# EAGLE design modular-mechaduino (EAGLE 9.6.2)
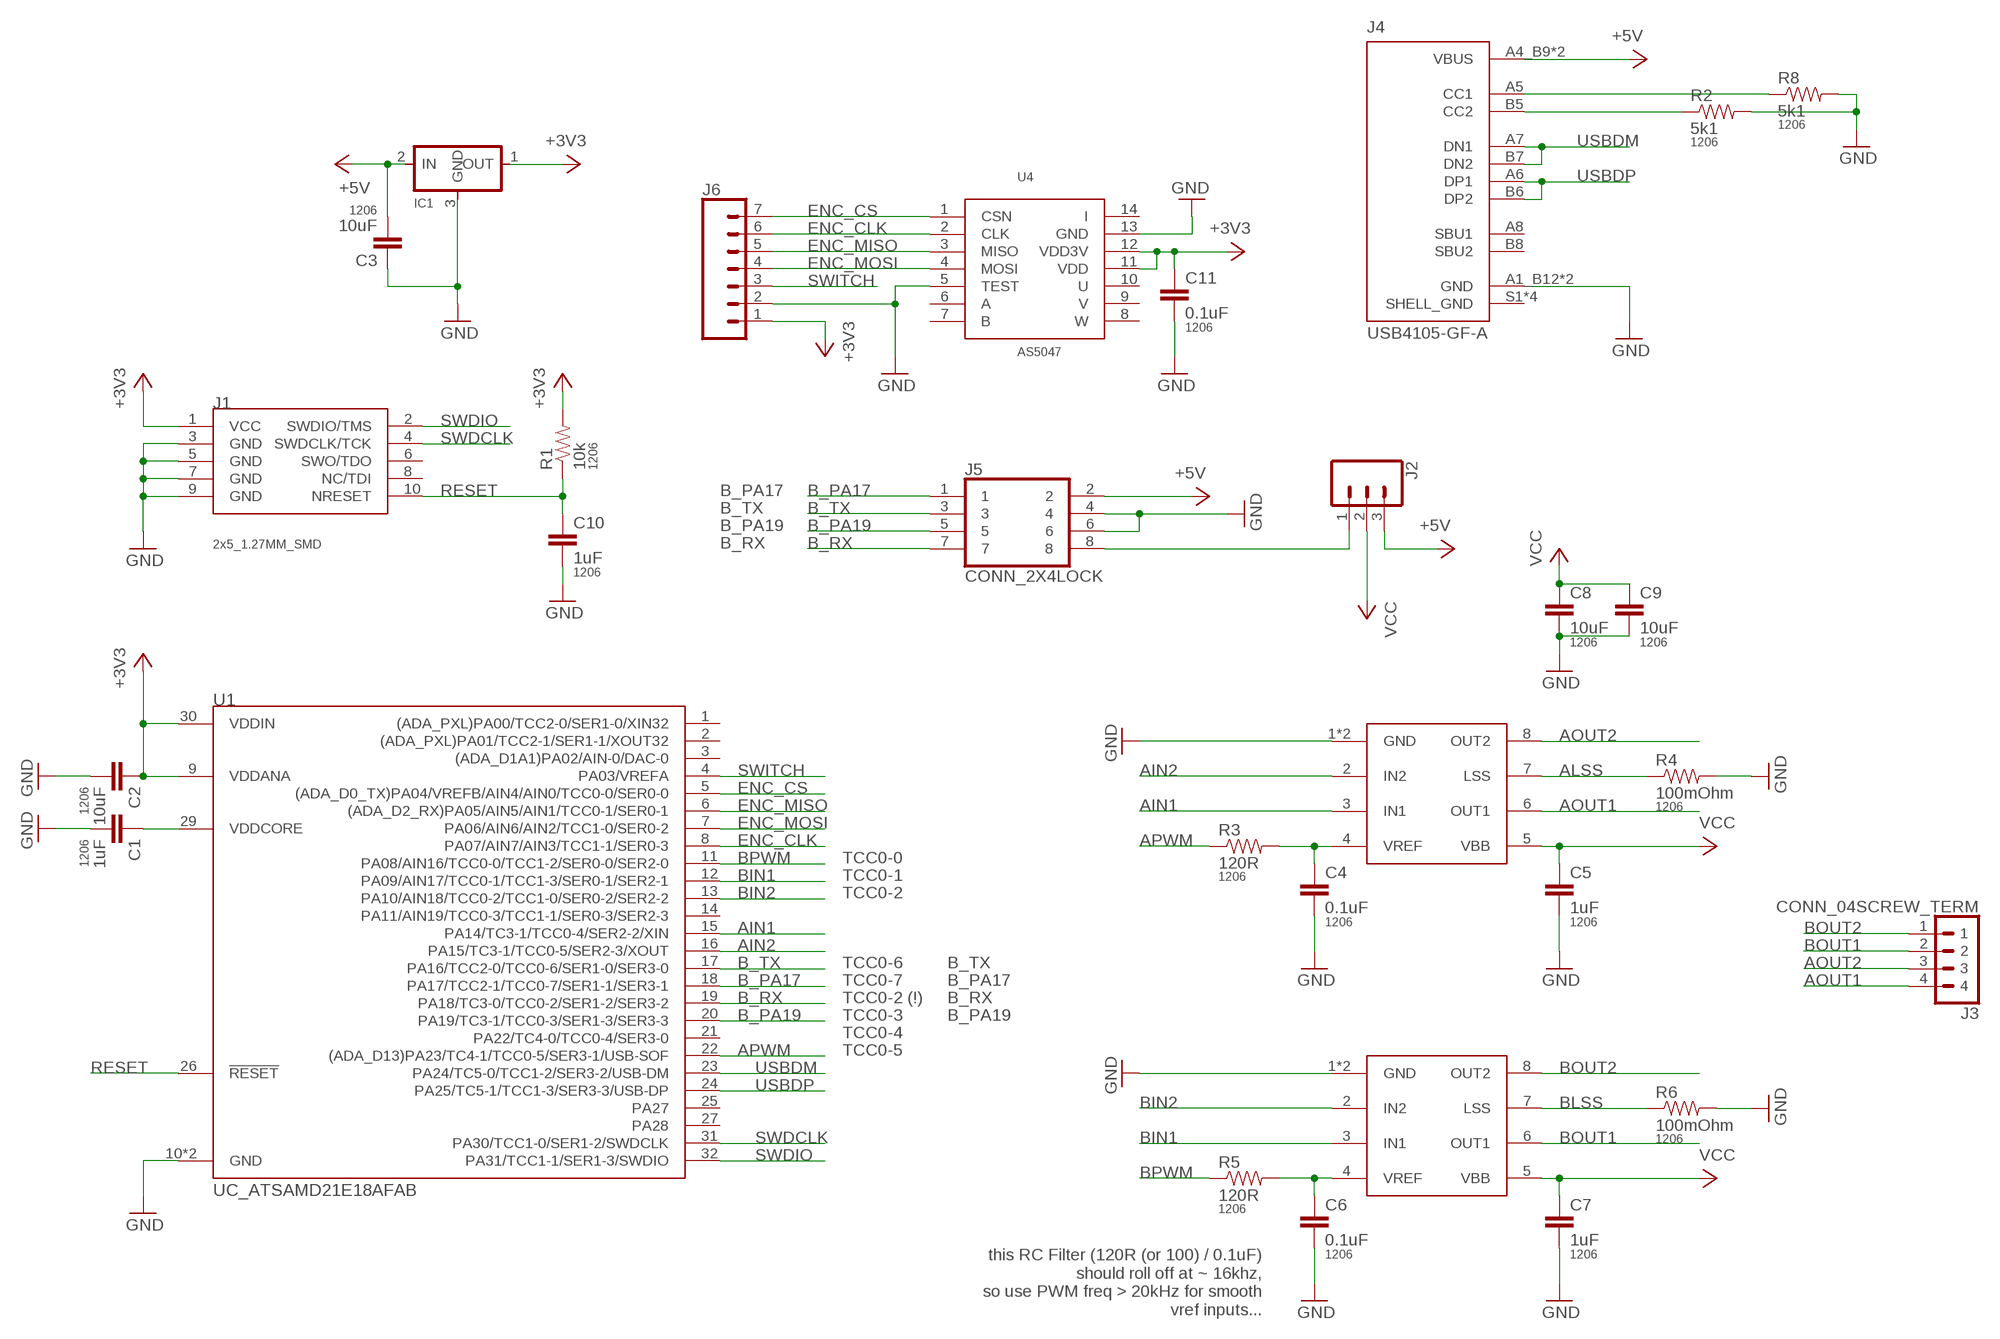
[diagram p0: schematic, sheet 1]

## Parts
C1  1uF  CAP1206  [1206]
C2  10uF  CAP1206  [1206]
C3  10uF  CAP1206  [1206]
C4  0.1uF  CAP1206  [1206]
C5  1uF  CAP1206  [1206]
C6  0.1uF  CAP1206  [1206]
C7  1uF  CAP1206  [1206]
C8  10uF  CAP1206  [1206]
C9  10uF  CAP1206  [1206]
C10  1uF  CAP1206  [1206]
C11  0.1uF  CAP1206  [1206]
IC1  VR_REGULATOR-SOT23SOT23  [SOT23]
J1  CONN_05X2_ARM_DEBUGSMD  [2X5_1.27MM_SMD]
J2  CONN_03LOCK_NO_SILK  [1X03_LOCK_NO_SILK]
J3  CONN_04SCREW_TERM  [1X04_SCREW-TERM]
J4  USB4105-GF-A  [GCT_USB4105-GF-A]
J5  CONN_2X4LOCK  [2X4-LOCK]
J6  CONN_07NO_SILK  [1X07_NO_SILK]
R1  10k  RESISTOR1206  [1206]
R2  5k1  RESISTOR1206  [1206]
R3  120R  RESISTOR1206  [1206]
R4  100mOhm  RESISTOR1206  [1206]
R5  120R  RESISTOR1206  [1206]
R6  100mOhm  RESISTOR1206  [1206]
R8  5k1  RESISTOR1206  [1206]
U1  UC_ATSAMD21E18AFAB  [TQFP-32-FAB]
U2  A4950  [SOIC8_PAD]
U3  A4950  [SOIC8_PAD]
U4  AS5047  [TSSOP14]

## Nets
+3V3: C2.1 C11.1 IC1.1(OUT) J1.1(VCC) J6.1 R1.2 U1.9(VDDANA) U1.30(VDDIN) U4.11(VDD) U4.12(VDD3V)
+5V: C3.2 IC1.2(IN) J2.3 J4.A4_B9(VBUS) J4.B4_A9(VBUS) J5.2
AIN1: U1.15(PA14/TC3-1/TCC0-4/SER2-2/XIN) U2.3(IN1)
AIN2: U1.16(PA15/TC3-1/TCC0-5/SER2-3/XOUT) U2.2(IN2)
ALSS: R4.1 U2.7(LSS)
AOUT1: J3.4 U2.6(OUT1)
AOUT2: J3.3 U2.8(OUT2)
APWM: R3.1 U1.22((ADA_D13)PA23/TC4-1/TCC0-5/SER3-1/USB-SOF)
B_PA17: J5.1 U1.18(PA17/TCC2-1/TCC0-7/SER1-1/SER3-1)
B_PA19: J5.5 U1.20(PA19/TC3-1/TCC0-3/SER1-3/SER3-3)
B_RX: J5.7 U1.19(PA18/TC3-0/TCC0-2/SER1-2/SER3-2)
B_TX: J5.3 U1.17(PA16/TCC2-0/TCC0-6/SER1-0/SER3-0)
BIN1: U1.12(PA09/AIN17/TCC0-1/TCC1-3/SER0-1/SER2-1) U3.3(IN1)
BIN2: U1.13(PA10/AIN18/TCC0-2/TCC1-0/SER0-2/SER2-2) U3.2(IN2)
BLSS: R6.1 U3.7(LSS)
BOUT1: J3.2 U3.6(OUT1)
BOUT2: J3.1 U3.8(OUT2)
BPWM: R5.1 U1.11(PA08/AIN16/TCC0-0/TCC1-2/SER0-0/SER2-0)
ENC_CLK: J6.6 U1.8(PA07/AIN7/AIN3/TCC1-1/SER0-3) U4.2(CLK)
ENC_CS: J6.7 U1.5((ADA_D0_TX)PA04/VREFB/AIN4/AIN0/TCC0-0/SER0-0) U4.1(CSN)
ENC_MISO: J6.5 U1.6((ADA_D2_RX)PA05/AIN5/AIN1/TCC0-1/SER0-1) U4.3(MISO)
ENC_MOSI: J6.4 U1.7(PA06/AIN6/AIN2/TCC1-0/SER0-2) U4.4(MOSI)
GND: C1.2 C2.2 C3.1 C4.2 C5.2 C6.2 C7.2 C8.2 C9.2 C10.2 C11.2 IC1.3(GND) J1.3(GND) J1.5(GND) J1.7(GND) J1.9(GND) J4.A1_B12(GND) J4.B1_A12(GND) J5.4 J5.6 J6.2 R2.2 R4.2 R6.2 R8.2 U1.10(GND) U1.28(GND) U2.1(GND) U2.P$1(GND) U3.1(GND) U3.P$1(GND) U4.5(TEST) U4.13(GND)
N$1: C1.1 U1.29(VDDCORE)
N$2: C4.1 R3.2 U2.4(VREF)
N$3: J4.B5(CC2) R2.1
N$4: J4.A5(CC1) R8.1
N$6: C6.1 R5.2 U3.4(VREF)
N$10: J2.1 J5.8
RESET: C10.1 J1.10(NRESET) R1.1 U1.26(!RESET)
SWDCLK: J1.4(SWDCLK/TCK) U1.31(PA30/TCC1-0/SER1-2/SWDCLK)
SWDIO: J1.2(SWDIO/TMS) U1.32(PA31/TCC1-1/SER1-3/SWDIO)
SWITCH: J6.3 U1.4(PA03/VREFA)
USBDM: J4.A7(DN1) J4.B7(DN2) U1.23(PA24/TC5-0/TCC1-2/SER3-2/USB-DM)
USBDP: J4.A6(DP1) J4.B6(DP2) U1.24(PA25/TC5-1/TCC1-3/SER3-3/USB-DP)
VCC: C5.1 C7.1 C8.1 C9.1 J2.2 U2.5(VBB) U3.5(VBB)
Unconnected: J1.6(SWO/TDO) J1.8(NC/TDI) J4.A8(SBU1) J4.B8(SBU2) U1.1((ADA_PXL)PA00/TCC2-0/SER1-0/XIN32) U1.2((ADA_PXL)PA01/TCC2-1/SER1-1/XOUT32) U1.3((ADA_D1A1)PA02/AIN-0/DAC-0) U1.14(PA11/AIN19/TCC0-3/TCC1-1/SER0-3/SER2-3) U1.21(PA22/TC4-0/TCC0-4/SER3-0) U1.25(PA27) U1.27(PA28) U4.6(A) U4.7(B) U4.8(W) U4.9(V) U4.10(U) U4.14(I)

## Notes on the sheet
- B_PA17
- B_TX
- B_PA19
- B_RX
- TCC0-0
- TCC0-1
- TCC0-2
- TCC0-6 | B_TX
- TCC0-7 | B_PA17
- TCC0-2 (!) | B_RX
- TCC0-3 | B_PA19
- TCC0-4
- TCC0-5
- this RC Filter (120R (or 100) / 0.1uF)
  should roll off at ~ 16khz,
  so use PWM freq > 20kHz for smooth
  vref inputs...

## Power pins joined to a net without a drawn wire
SHELL_GND: J4.S1(SHELL_GND) J4.S2(SHELL_GND) J4.S3(SHELL_GND) J4.S4(SHELL_GND)

## Library data of the parts
C1-C11 = jrr_passives:CAP: Capacitor Standard 0603 ceramic capacitor, and 0.1" leaded capacitor.; PACKAGE: 1206
IC1 = fablab:VR_REGULATOR-SOT23
J1 = fablab:CONN_05X2_ARM_DEBUG; PACKAGE: 2x5_1.27MM_SMD
J2 = SparkFun-Connectors:CONN_03: Multi connection point. Often used as Generic Header-pin footprint for 0.1 inch spaced/style header connections On any of the 0.1 inch spaced packages, you can populate with these: Break Away Headers - Straight <https://www.sparkfun.com/products/116> (PRT-00116) Break Away Male Headers - Right Angle <https://www.sparkfun.com/products/553> (PRT-00553) Female Headers <https://www.sparkfun.com/products/115> (PRT-00115) Break Away Headers - Machine Pin <https://www.sparkfun.com/products/117> (PRT-00117) Break Away Female Headers - Swiss Machine Pin <https://www.sparkfun.com/products/743> (PRT-00743) Stackable Header - 3 Pin (Female, 0.1") <https://www.sparkfun.com/products/13875> (PRT-13875) For SCREWTERMINALS and SPRING TERMINALS visit here: Screw Terimnals on SparkFun.com <https://www.sparkfun.com/search/results?term=Screw+Terminals> (5mm/3.5mm/2.54mm spacing) This device is also useful as a general connection point to wire up your design to another part of your project. Our various solder wires solder well into these plated through hole pads. Hook-Up Wire - Assortment (Stranded, 22 AWG) <https://www.sparkfun.com/products/11375> (PRT-11375) Hook-Up Wire - Assortment (Solid Core, 22 AWG) <https://www.sparkfun.com/products/11367> (PRT-11367) View the entire wire category on our website here <https://www.sparkfun.com/categories/141> Special notes: Molex polarized connector foot print use with SKU : PRT-08232 with associated crimp pins and housings.
J3 = jrr_connector:CONN_04
J4 = jrr_connector:USB4105-GF-A: USB-C (USB TYPE-C) USB 2.0 Receptacle Connector 24 (16+8 Dummy) Position Surface Mount, Right Angle; Through Hole Check prices <https://pricing.snapeda.com/parts/USB4105-GF-A/GCT/view-part?ref=eda>; AVAILABILITY: In Stock; DESCRIPTION: USB-C (USB TYPE-C) USB 2.0 Receptacle Connector 24 (16+8 Dummy) Position Surface Mount, Right Angle; Through Hole; MF: GCT; MP: USB4105-GF-A; PACKAGE: None; PRICE: None; PURCHASE-URL: https://pricing.snapeda.com/search/part/USB4105-GF-A/?ref=eda
J5 = jrr_connector:CONN_2X4
J6 = SparkFun-Connectors:CONN_07: Multi connection point. Often used as Generic Header-pin footprint for 0.1 inch spaced/style header connections On any of the 0.1 inch spaced packages, you can populate with these: Break Away Headers - Straight <https://www.sparkfun.com/products/116> (PRT-00116) Break Away Male Headers - Right Angle <https://www.sparkfun.com/products/553> (PRT-00553) Female Headers <https://www.sparkfun.com/products/115> (PRT-00115) Break Away Headers - Machine Pin <https://www.sparkfun.com/products/117> (PRT-00117) Break Away Female Headers - Swiss Machine Pin <https://www.sparkfun.com/products/743> (PRT-00743) For SCREWTERMINALS and SPRING TERMINALS visit here: Screw Terimnals on SparkFun.com <https://www.sparkfun.com/search/results?term=Screw+Terminals> (5mm/3.5mm/2.54mm spacing) This device is also useful as a general connection point to wire up your design to another part of your project. Our various solder wires solder well into these plated through hole pads. Hook-Up Wire - Assortment (Stranded, 22 AWG) <https://www.sparkfun.com/products/11375> (PRT-11375) Hook-Up Wire - Assortment (Solid Core, 22 AWG) <https://www.sparkfun.com/products/11367> (PRT-11367) View the entire wire category on our website here <https://www.sparkfun.com/categories/141> Special notes: Molex polarized connector foot print use with SKU : PRT-08231 with associated crimp pins and housings. 1MM SMD Version SKU: PRT-10208 NOTES ON THE VARIANTS LOCK and LOCK_LONGPADS... This footprint was designed to help hold the alignment of a through-hole component (i.e. 6-pin header) while soldering it into place. You may notice that each hole has been shifted either up or down by 0.005 of an inch from it's more standard position (which is a perfectly straight line). This slight alteration caused the pins (the squares in the middle) to touch the edges of the holes. Because they are alternating, it causes a "brace" to hold the component in place. 0.005 has proven to be the perfect amount of "off-center" position when using our standard breakaway headers. Although looks a little odd when you look at the bare footprint, once you have a header in there, the alteration is very hard to notice. Also,if you push a header all the way into place, it is covered up entirely on the bottom side.
R1-R6 R8 = jrr_passives:RESISTOR: Resistor Basic schematic elements and footprints for 0603, 1206, and PTH resistors.; PACKAGE: 1206
U1 = fablab:UC_ATSAMD21E18A: The SAM D21 is a series of low-power microcontrollers using the 32-bit ARM® Cortex® -M0+ processor, and ranging from 32- to 64-pins with up to 256KB Flash and 32KB of SRAM. The SAM D21 operate at a maximum frequency of 48MHz and reach 2.46 CoreMark® /MHz. Check prices <https://pricing.snapeda.com/parts/ATSAMD21E18A-AF/Microchip/view-part?ref=eda>
U2 U3 = jrr_power:A4950
U4 = jrr_sensor:AS5047

## Board
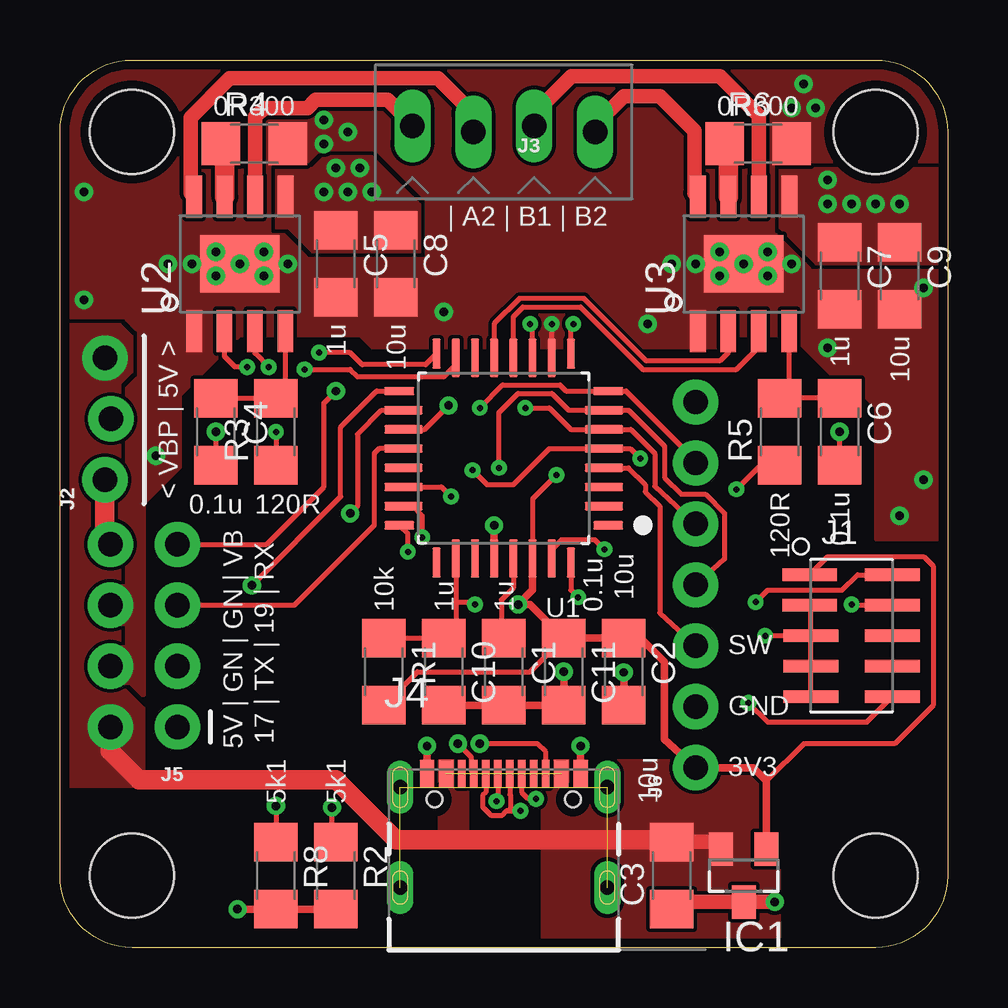
[diagram p1: board, top side]
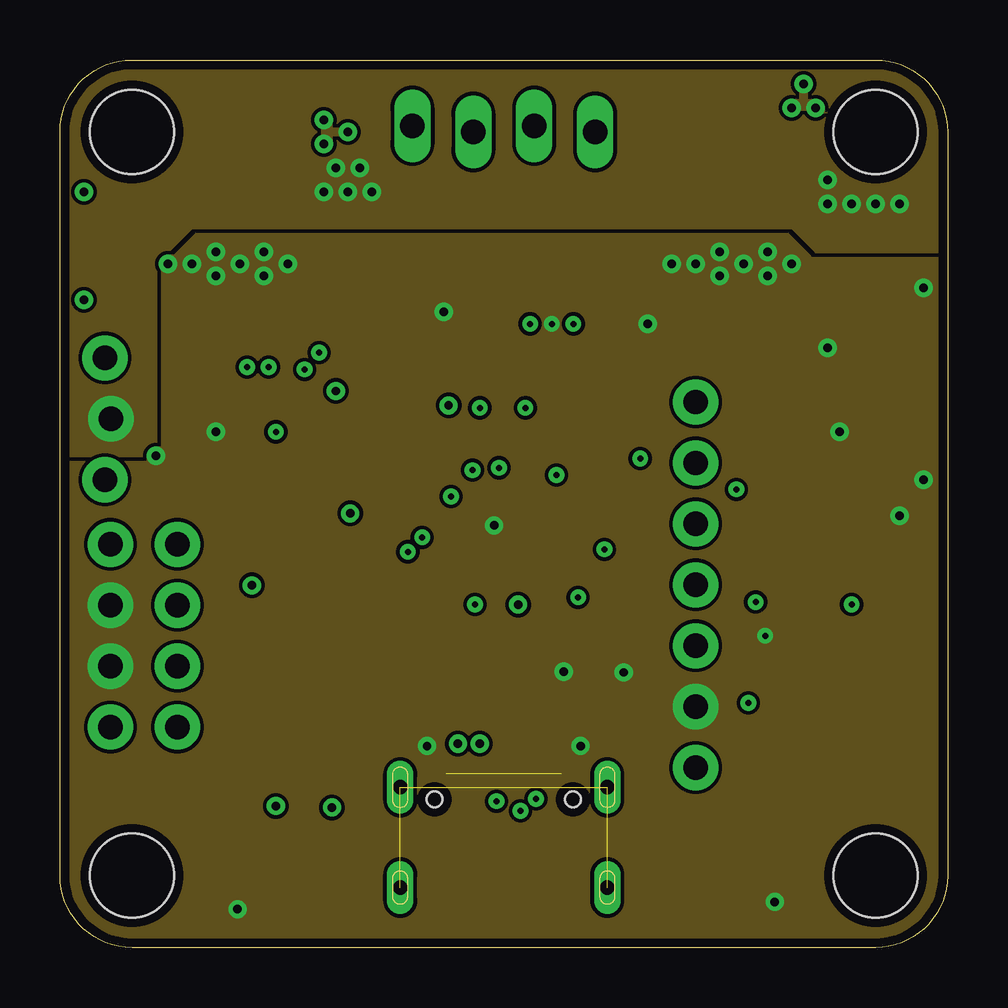
[diagram p2: board, inner layer Route2]
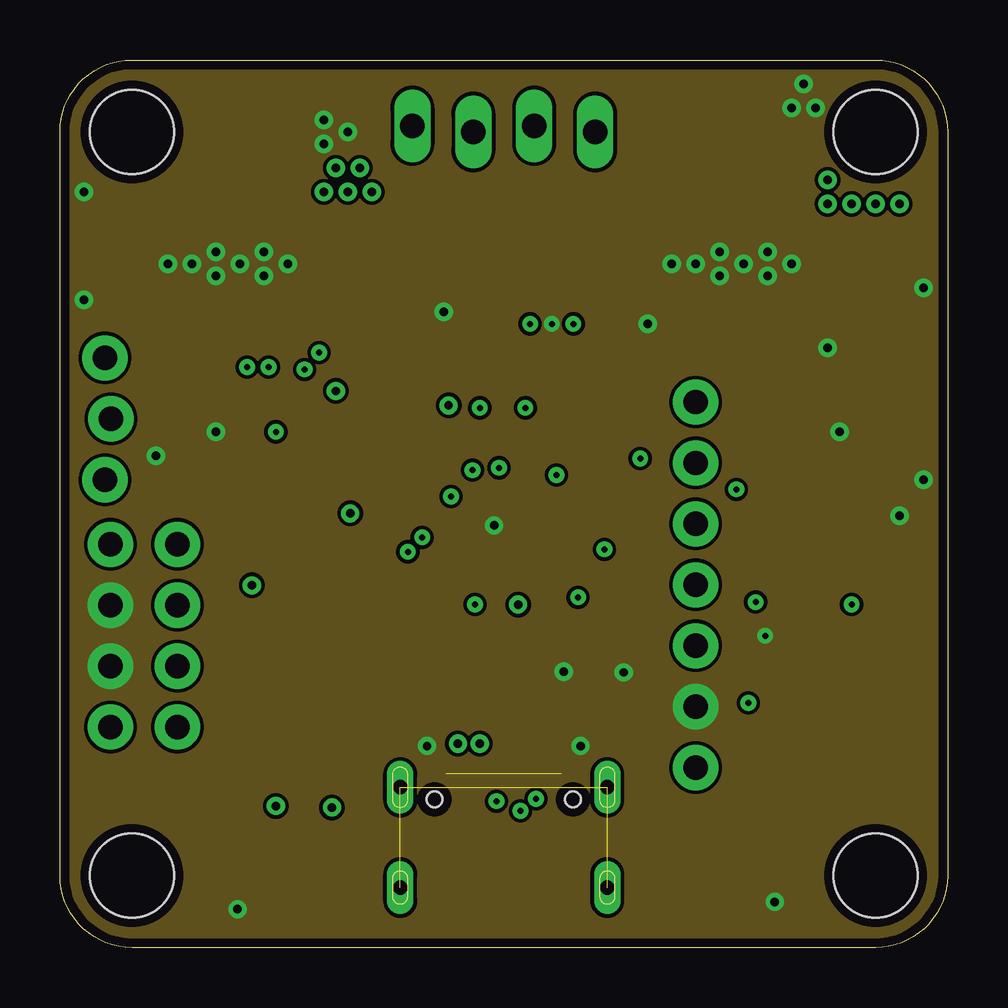
[diagram p3: board, inner layer Route15]
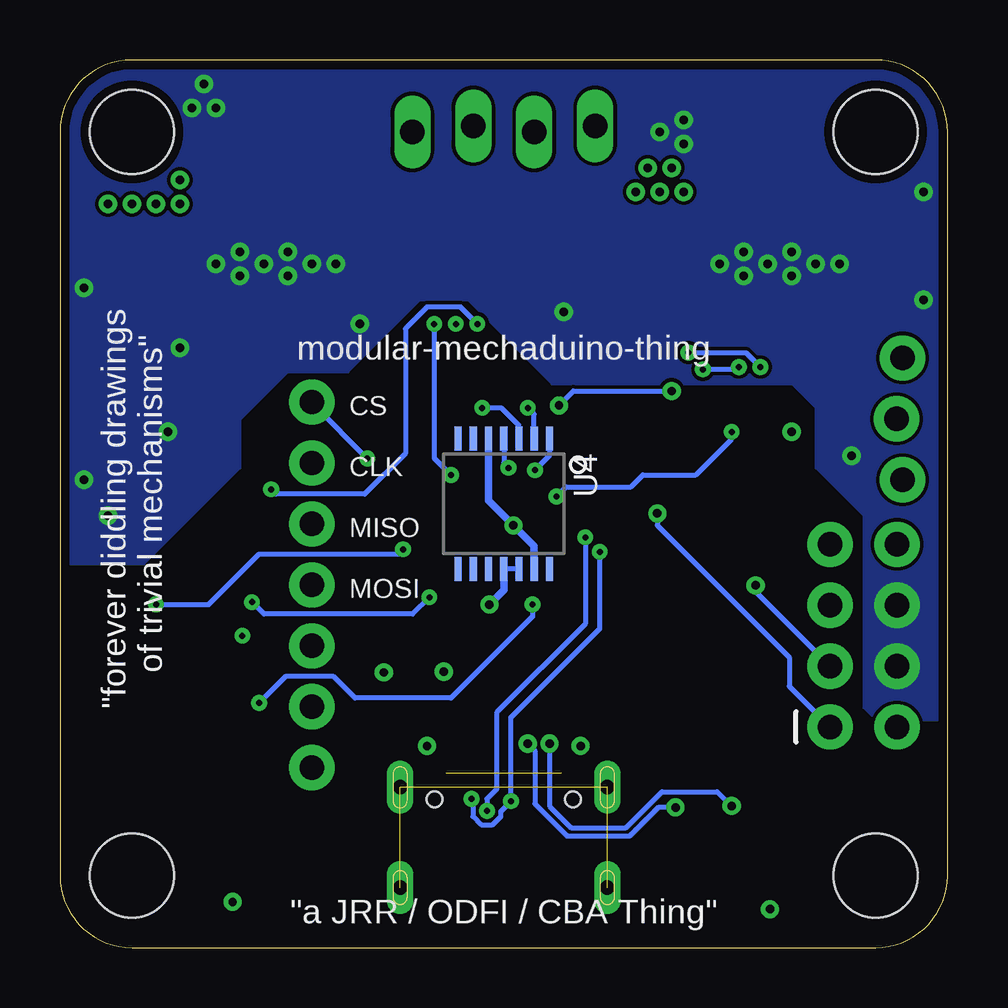
[diagram p4: board, bottom side, seen from below]

Size 37 x 37 mm. Coordinates in mm from the lower left corner, seen from the top.
Outline: 3,37 34,37 arc-90 37,34 37,3 arc-90 34,0 3,0 arc-90 0,3 0,34 arc-90 3,37
Copper layers (1+2*15+16): Top 0.035mm / dielectric 1.5mm / Route2 0.035mm / dielectric 0.15mm / Route15 0.035mm / dielectric 0.2mm / Bottom 0.035mm
Design rules "default *": minimum track width 8mil, minimum drill 0.25mm, track to track 6mil, track to pad 6mil, pad to pad 6mil, via to via 6mil, smd to smd 0mil, copper to edge 15mil, drill to drill 17mil, minimum pad ring 10mil, minimum via ring 8mil, stop-mask expansion 4mil, vias tented up to drill 60mil, thermal gap 10mil
Holes 3.5 mm at 34,3 3,3 3,34 34,34

### Footprints (pad centres in the part's own frame; a part is rotated, then mirrored left to right if it is on the bottom)
1206 = smd 1.6 x 1.8: 1 -1.4,0; 2 1.4,0
SOT23 = smd 1 x 1.4: 1 -0.95,-1.1; 2 0.95,-1.1; 3 0,1.1
2X5_1.27MM_SMD = smd 2.286 x 0.508: 1 -1.752,2.54; 2 1.702,2.54; 3 -1.752,1.27; 4 1.702,1.27; 5 -1.702,0; 6 1.702,0; 7 -1.702,-1.27; 8 1.702,-1.27; 9 -1.702,-2.54; 10 1.702,-2.54
1X03_LOCK_NO_SILK = drill 1.016 pad 1.88: 1 0,0.127; 2 2.54,-0.127; 3 5.08,0.127
1X04_SCREW-TERM = drill 1.016 long: 1 -3.81,0; 2 -1.27,-0.254; 3 1.27,0; 4 3.81,-0.254
GCT_USB4105-GF-A = smd 0.6 x 1.15: A1_B12 -3.2,4.755; A4_B9 -2.4,4.755; B1_A12 3.2,4.755; B4_A9 2.4,4.755 | smd 0.3 x 1.15: A5 -1.25,4.755; A6 -0.25,4.755; A7 0.25,4.755; A8 1.25,4.755; B5 1.75,4.755; B6 0.75,4.755; B7 -0.75,4.755; B8 -1.75,4.755 | drill 0.6 pad 1.05 long: S1 -4.32,4.18; S4 4.32,4.18 | drill 0.6 pad 1 long: S2 -4.32,0; S3 4.32,0 | hole 0.65: 2.89,3.68; -2.89,3.68
2X4-LOCK = drill 1.016 pad 1.88: 1 -1.397,3.81; 2 1.397,3.81; 3 -1.397,1.27; 4 1.397,1.27; 5 -1.397,-1.27; 6 1.397,-1.27; 7 -1.397,-3.81; 8 1.397,-3.81
1X07_NO_SILK = drill 1.016 pad 1.88: 1 0,0; 2 2.54,0; 3 5.08,0; 4 7.62,0; 5 10.16,0; 6 12.7,0; 7 15.24,0
TQFP-32-FAB = smd 1.25 x 0.35: 1 -4.355,2.8; 8 -4.355,-2.8; 17 4.355,-2.8; 24 4.355,2.8 | smd 1.6 x 0.35: 2 -4.18,2; 3 -4.18,1.2; 4 -4.18,0.4; 5 -4.18,-0.4; 6 -4.18,-1.2; 7 -4.18,-2; 18 4.18,-2; 19 4.18,-1.2; 20 4.18,-0.4; 21 4.18,0.4; 22 4.18,1.2; 23 4.18,2 | smd 0.35 x 1.25: 9 -2.8,-4.355; 16 2.8,-4.355; 25 2.8,4.355; 32 -2.8,4.355 | smd 0.35 x 1.6: 10 -2,-4.18; 11 -1.2,-4.18; 12 -0.4,-4.18; 13 0.4,-4.18; 14 1.2,-4.18; 15 2,-4.18; 26 2,4.18; 27 1.2,4.18; 28 0.4,4.18; 29 -0.4,4.18; 30 -1.2,4.18; 31 -2,4.18
SOIC8_PAD = smd 1.75 x 0.65: 1 -2.8,1.905; 2 -2.8,0.645; 3 -2.8,-0.625; 4 -2.8,-1.895; 5 2.8,-1.905; 6 2.8,-0.635; 7 2.8,0.635; 8 2.8,1.905 | smd 2.41 x 3.3: P$1 0,0
TSSOP14 = smd 0.305 x 0.991: 1 -1.905,-2.718; 2 -1.27,-2.718; 3 -0.635,-2.718; 4 0,-2.718; 5 0.635,-2.718; 6 1.27,-2.718; 7 1.905,-2.718; 8 1.905,2.718; 9 1.27,2.718; 10 0.635,2.718; 11 0,2.718; 12 -0.635,2.718; 13 -1.27,2.718; 14 -1.905,2.718

### Placement (x,y rotation side)
C1  18.5,11.5 270 top
C2  23.5,11.5 270 top
C3  25.5,3 90 top
C4  6.5,21.5 270 top
C5  11.5,28.5 270 top
C6  32.5,21.5 270 top
C7  32.5,28 270 top
C8  14,28.5 270 top
C9  35,28 270 top
C10  16,11.5 270 top
C11  21,11.5 270 top
IC1  28.5,3 180 top
J1  33,13 0 top
J2  2,19.5 90 top
J3  18.5,34 180 top
J4  18.5,2.5 0 top
J5  3.5,13 180 top
J6  26.5,7.5 90 top
R1  13.5,11.5 270 top
R2  11.5,3 270 top
R3  9,21.5 90 top
R4  8.1,33.51 0 top
R5  30,21.5 90 top
R6  29.1,33.51 0 top
R8  9,3 270 top
U1  18.5,20.4 180 top
U2  7.5,28.5 90 top
U3  28.5,28.5 90 top
U4  18.5,18.5 180 bottom

### Tracks (layer width: path | path; a pad name or v marks a point on that pad's centre or on a via)
+3V3  (via drill 0.25, 0.35)
  Top 0.203: U1.9 21.3,25.9 v21.4,26 | v20.7,19.7 19.7,18.7 U1.30 | J1.1 32.01,16.3 36,16.3 36.4,15.9 36.4,10.1 34.8,8.5 31,8.5 29.45,6.95 | R1.2 14.9,11.5 19.6,11.5 C11.1
  Top 0.305: U1.30 19.7,14.9 v19.1,14.3 19.6,14.3 C11.1 C2.1 24.2,12.9 25.2,11.9 25.2,8.67 J6.1 28.9,7.5 29.45,6.95 IC1.1
  Bottom 0.203: v21.4,26 21.4,20.4 v20.7,19.7 | U4.12 U4.11
  Bottom 0.305: U4.11 18.5,14.9 v19.1,14.3
+5V  (1 unrouted)
  Top 0.61: IC1.2 27.25,4.4 C3.2
  Top 0.813: J5.2 2.1,8.2 3.3,7 11.5,7 14,4.5 25.4,4.5 C3.2
  pour Top (no thermals): 15.8,7.8 15.8,4.3 17,4.3 17,7.8
  pour Top (rank 6, no thermals): 20.1,7.8 20.1,-0.5 30,-0.5 30,7.8
  pour Top (rank 5, no thermals): 3.5,6.7 3.5,10 2.5,11 2.5,23.5 3,24 3,25.5 2.5,26 -0.5,26 -0.5,6.7
AIN1  (via drill 0.25)
  Top 0.203: U2.3 8.12,24.77 v8.7,24.2 | v10.2,24.1 12.1,24.1 12.4,23.8 16,23.8 16.5,24.3 U1.15
  Bottom 0.203: v8.7,24.2 8.8,24.1 v10.2,24.1
AIN2  (via drill 0.25)
  Top 0.203: U1.16 15.24,24.3 12.6,24.3 12.1,24.8 v10.8,24.8 | v7.8,24.2 7.3,24.2 6.86,24.64 U2.2
  Bottom 0.203: v7.8,24.2 8.4,24.8 v10.8,24.8
ALSS
  Top 0.813: U2.7 6.87,33.34 R4.1
AOUT1
  Top 0.61: U2.6 8.13,34.63 8.5,35 10.32,35 10.65,35.34 13.66,35.34 14.69,34.31 J3.4
AOUT2
  Top 0.61: U2.8 5.44,31.45 5.44,34.6 7.08,36.23 15.77,36.23 17.23,34.77 J3.3
APWM  (via drill 0.25)
  Top 0.203: U1.22 15.9,19.2 v16.3,18.8 | v9,21.5 R3.1
  Bottom 0.203: v16.3,18.8 15.9,19.2 13.2,19.2 12.7,19.7 10.5,19.7 9,21.2 v9,21.5
B_PA17  (via drill 0.35)
  Top 0.203: v12.1,18.1 12.4,18.4 12.4,21.39 13.41,22.4 U1.18
  Bottom 0.203: J5.1 6.6,10.89 6.6,12.1 12.1,17.6 v12.1,18.1
B_PA19
  Top 0.203: J5.5 9.77,14.27 13.1,17.6 13.1,20.6 13.3,20.8 U1.20
B_RX  (via drill 0.35)
  Top 0.203: J5.7 8.61,16.81 11,19.2 11,22.7 v11.5,23.2 | U1.19 15.2,21.6 v16.2,22.6
  Bottom 0.203: v16.2,22.6 15.6,23.2 v11.5,23.2
B_TX  (via drill 0.35)
  Top 0.203: v8,15.1 11.7,18.8 11.7,21.7 13.2,23.2 U1.17
  Bottom 0.203: J5.3 8,14.83 v8,15.1
BIN1
  Top 0.203: U1.12 18.9,26.3 19.3,26.7 21.7,26.7 24.3,24.1 28.2,24.1 29.2,25.1 29.2,25.62 U3.3
BIN2
  Top 0.203: U3.2 27.86,24.81 27.5,24.46 24.45,24.46 21.85,27.06 19.15,27.06 18.1,26 U1.13
BLSS
  Top 0.813: R6.1 27.86,33.34 U3.7
BOUT1
  Top 0.61: U3.6 29.14,34.68 27.5,36.31 21.31,36.31 19.77,34.77 J3.2
BOUT2
  Top 0.61: J3.1 22.31,34.31 23.5,35.5 25,35.5 26.44,34.06 26.44,31.45 U3.8
BPWM  (via drill 0.25)
  Top 0.203: U1.11 19.7,25.9 v19.6,26 | v28.2,19.1 29.2,20.1 R5.1
  Bottom 0.203: v19.6,26 20.3,26.7 21.7,26.7 22.6,25.8 22.6,20.6 24.3,18.9 28,18.9 v28.2,19.1
ENC_CLK  (via drill 0.25)
  Top 0.203: v17.5,22.5 18.46,23.46 20.84,23.46 21.1,23.2 U1.8 23.6,23.2 26.6,20.2 J6.6
  Bottom 0.203: U4.2 17.23,22.23 v17.5,22.5
ENC_CS  (via drill 0.25)
  Top 0.203: v17.2,19.9 17.8,19.3 18.9,19.3 20.4,20.8 U1.5 23.78,20.8 v24.19,20.39
  Bottom 0.203: U4.1 16.59,20.5 v17.2,19.9 | v24.19,20.39 26.37,22.57 J6.7
ENC_MISO  (via drill 0.25)
  Top 0.203: v19.4,22.5 20.4,22.5 21.3,21.6 U1.6 23.8,21.6 24.8,20.6 24.8,19.23 J6.5
  Bottom 0.203: U4.3 17.86,21.77 18.6,22.5 v19.4,22.5
ENC_MOSI  (via drill 0.25)
  Top 0.203: v18.3,20 18.3,22.3 19.1,23.1 20.5,23.1 21.2,22.4 U1.7 23.7,22.4 25.2,20.9 25.2,19.6 25.9,18.9 26.9,18.9 27.7,18.1 27.7,16.19 J6.4
  Bottom 0.203: U4.4 18.5,20.2 v18.3,20
GND  (via drill 0.25, 0.35)
  Top 0.203: U1.10 v20.5,26 | J1.9 J1.7 J1.5 | J1.5 31.3,14.22 J1.3 | J1.5 v29.4,13 | C6.2 v32.5,21.5 | C4.2 v6.5,21.5
  Top 0.305: C10.2 C1.2 C11.2 v21,11.5 | U1.28 v18.1,17.6 | J4.A1_B12 v15.3,8.4 | J4.B1_A12 v21.7,8.4 | R2.2 R8.2 v7.4,1.6 | C2.2 v23.5,11.47
  Top 0.61: C3.1 25.8,1.9 IC1.3 v29.8,1.9
  Bottom 0.305: U4.5 19.14,18.64 v18.1,17.6 17.23,16.73 U4.13
  other vias: 12,34 11,34.5 11,33.5 30.5,35 31.5,35 31,36 27.5,29 29.5,29 29.5,28 27.5,28 28.5,28.5 8.5,28 8.5,29 6.5,29 6.5,28 7.5,28.5 9.5,28.5 5.5,28.5 26.5,28.5 30.5,28.5 36,27.5 32,25 35,18 36,19.5 16,26.5 24.5,26 1,27 4,20.5 1,31.5 4.5,28.5 25.5,28.5
  pour Route2 (rank 6, no thermals): -1.5,-1.5 -1.5,38.5 38.5,38.5 38.5,-1.5
  pour Route15 (rank 6, no thermals): -2.5,-2.5 -2.5,39.5 39.5,39.5 39.5,-2.5
  pour Top (rank 3, no thermals): 32,32.5 32,38 30,38 30,32.5
  pour Top (rank 3, no thermals): 9,32.5 9,35 12.5,35 12.5,32.5
  pour Top (rank 6, no thermals): 12.5,25.5 7.5,25.5 5,23 5,20 3.5,18.5 3.5,10.5 -3,10.5 -3,40 40,40 40,17 34,17 34,22.5 33,23.5 32.5,23.5 30.5,25.5 28,25.5 27.5,25 13,25
  pour Bottom (rank 6, no thermals): 27.5,24 29.5,22 29.5,20 33.5,16 38,16 38,38 -1,38 -1,9.5 3,9.5 3.5,10 3.5,18 5.5,20 5.5,22.5 6.5,23.5 16.5,23.5 20,27 22,27 25,24
N$1
  Top 0.203: U1.29 18.9,15 18.4,14.5 18.4,13 C1.1
N$2
  Top 0.203: C4.1 R3.2 9.39,23.3 U2.4
N$3  (via drill 0.35)
  Top 0.203: J4.B5 20.25,8.15 19.9,8.5 v17.5,8.5 | R2.1 11.34,4.56 v11.34,5.84
  Bottom 0.203: v17.5,8.5 17.2,8.2 17.2,6 15.84,4.64 13.25,4.64 12.06,5.84 v11.34,5.84
N$4  (via drill 0.35)
  Top 0.203: J4.A5 17.15,7.35 17.15,7.93 v16.59,8.5 | v9,5.9 R8.1
  Bottom 0.203: v16.59,8.5 16.59,5.89 15.7,5 13.4,5 11.9,6.5 9.6,6.5 v9,5.9
N$6
  Top 0.203: C6.1 R5.2 30.39,23.3 U3.4
N$10
  Top 0.813: J5.8 1.87,17.04 J2.1
RESET  (via drill 0.25)
  Top 0.203: U1.26 16.5,14.4 | 16.5,14.4 16.5,13.4 C10.1 R1.1 | 16.5,14.4 17.2,14.4 v17.3,14.3 | v28.7,10.2 29.5,9.4 33.64,9.4 J1.10
  Bottom 0.203: v17.3,14.3 17.3,13.8 20.7,10.4 24.7,10.4 25.6,11.3 27.6,11.3 v28.7,10.2
SHELL_GND  (3 unrouted)
SWDCLK  (via drill 0.25)
  Top 0.203: J1.4 33.03,14.27 v33,14.3 | v22.7,16.6 22.3,17 20.9,17 20.5,16.6 U1.31
  Bottom 0.203: v33,14.3 30.8,14.3 28.7,16.4 22.9,16.4 v22.7,16.6
SWDIO  (via drill 0.25)
  Top 0.203: U1.32 21.3,14.9 v21.6,14.6 | v29,14.4 29.5,14.9 32.6,14.9 33.24,15.54 J1.2
  Bottom 0.203: v21.6,14.6 22.3,13.9 28.5,13.9 v29,14.4
SWITCH
  Top 0.203: U1.4 23.7,20 24.4,19.3 24.4,19 25,18.4 25,13.95 J6.3
USBDM  (via drill 0.25)
  Top 0.203: 18.7,5.7 18.62,5.7 18.44,5.52 17.96,5.52 17.62,5.86 17.62,6.34 17.75,6.47 J4.B7 | 18.7,5.7 v19.2,5.7 | J4.A7 18.75,6.37 18.78,6.34 18.78,5.78 18.7,5.7 | U1.23 14.7,18.4 15.1,18 v15.1,17.1
  Bottom 0.203: v15.1,17.1 15.1,13.5 18.8,9.8 18.8,6.6 19.2,6.2 v19.2,5.7
USBDP  (via drill 0.25)
  Top 0.203: J4.A6 18.25,6.15 v18.2,6.1 | J4.B6 19.25,6.47 19.5,6.23 19.82,6.23 v19.84,6.2 | v14.5,16.5 14.5,17.25 U1.24
  Bottom 0.203: v14.5,16.5 14.5,13.3 18.2,9.6 v18.2,6.1 18.62,5.68 18.62,5.46 18.96,5.12 19.44,5.12 19.78,5.46 19.78,6.14 v19.84,6.2
VCC  (via drill 0.35)
  other vias: 11,31.5 12,31.5 11.5,32.5 12.5,32.5 13,31.5 32,32 32,31 33,31 34,31 35,31
  pour Route2 (rank 2, no thermals): 4,21 4,28.5 5.5,30 30.5,30 31.5,29 37.5,29 37.5,37.5 -0.5,37.5 -0.5,20.5 3.5,20.5
  pour Top (rank 2, no thermals): 30,32.5 37.5,32.5 37.5,28.5 31.5,28.5 30,30
  pour Top (rank 2, no thermals): 9,32.5 10.5,32.5 11,33 13,33 15,31 15,29 10.5,29 9.5,30 9,30

### Text on the board
tPlace: 0R300 | 0R300 | | A2 | B1 | B2 | 1u | 10u | 1u | 10u | < VBP | 5V > | 120R | 0.1u | 0.1u | 120R | 10k | 1u | 1u | 0.1u | 10u | SW | GND | 5V | GN | GN | VB | 17 | TX | 19 | RX | 3V3 | 5k1 | 5k1 | 10u
bPlace: modular-mechaduino-thing | CS | CLK | MISO | "forever diddling drawings / of trivial mechanisms" | MOSI | "a JRR / ODFI / CBA Thing"